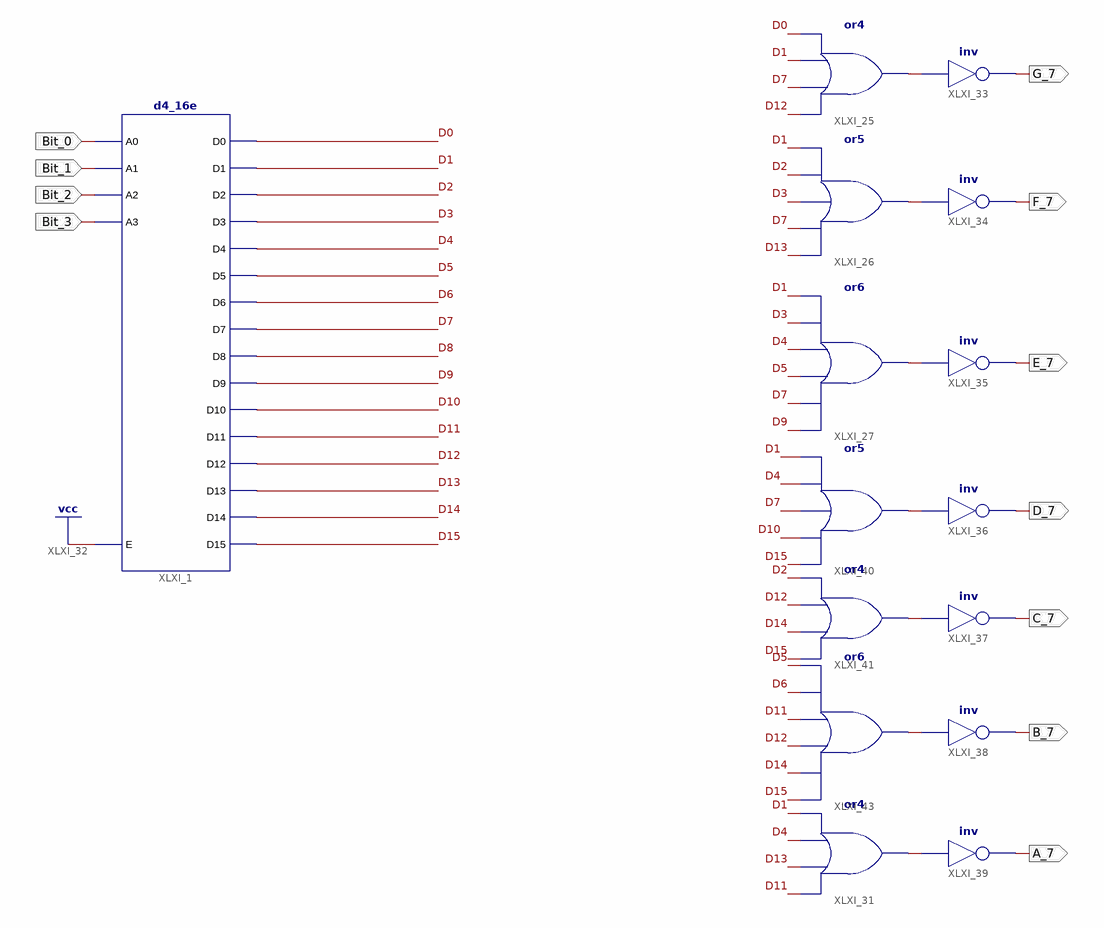
[diagram p0: schematic sheet 1]
// Xilinx ISE schematic BCD_0_F_Decoder.sch (spartan6) as structural Verilog: 15 symbols, 11 ports
module BCD_0_F_Decoder (
  input  Bit_0,
  input  Bit_1,
  input  Bit_2,
  input  Bit_3,
  output G_7,
  output F_7,
  output E_7,
  output D_7,
  output C_7,
  output A_7,
  output B_7
);

  wire A, B, C, D0, D1, D2, D3, D4, D5, D6, D7, D8, D9, D10, D11, D12, D13, D14, D15, E, F, G, XLXN_38;

  d4_16e XLXI_1 (
    .A0(Bit_0), .A1(Bit_1), .A2(Bit_2), .A3(Bit_3), .E(1'b1), .D0(D0), .D1(D1), .D10(D10), .D11(D11),
    .D12(D12), .D13(D13), .D14(D14), .D15(D15), .D2(D2), .D3(D3), .D4(D4), .D5(D5), .D6(D6), .D7(D7),
    .D8(D8), .D9(D9));
  or XLXI_25 (G, D12, D7, D1, D0);
  or XLXI_26 (F, D13, D7, D3, D2, D1);
  or XLXI_27 (E, D9, D7, D5, D4, D3, D1);
  or XLXI_31 (A, D11, D13, D4, D1);
  not XLXI_33 (G_7, G);
  not XLXI_34 (F_7, F);
  not XLXI_35 (E_7, E);
  not XLXI_36 (D_7, XLXN_38);
  not XLXI_37 (C_7, C);
  not XLXI_39 (A_7, A);
  or XLXI_40 (XLXN_38, D15, D10, D7, D4, D1);
  or XLXI_41 (C, D15, D14, D12, D2);
  not XLXI_38 (B_7, B);
  or XLXI_43 (B, D15, D14, D12, D11, D6, D5);
endmodule
